# EAGLE design MRCS-Remote-Switch-Motor-Controller-Relay (EAGLE 7.7.0)
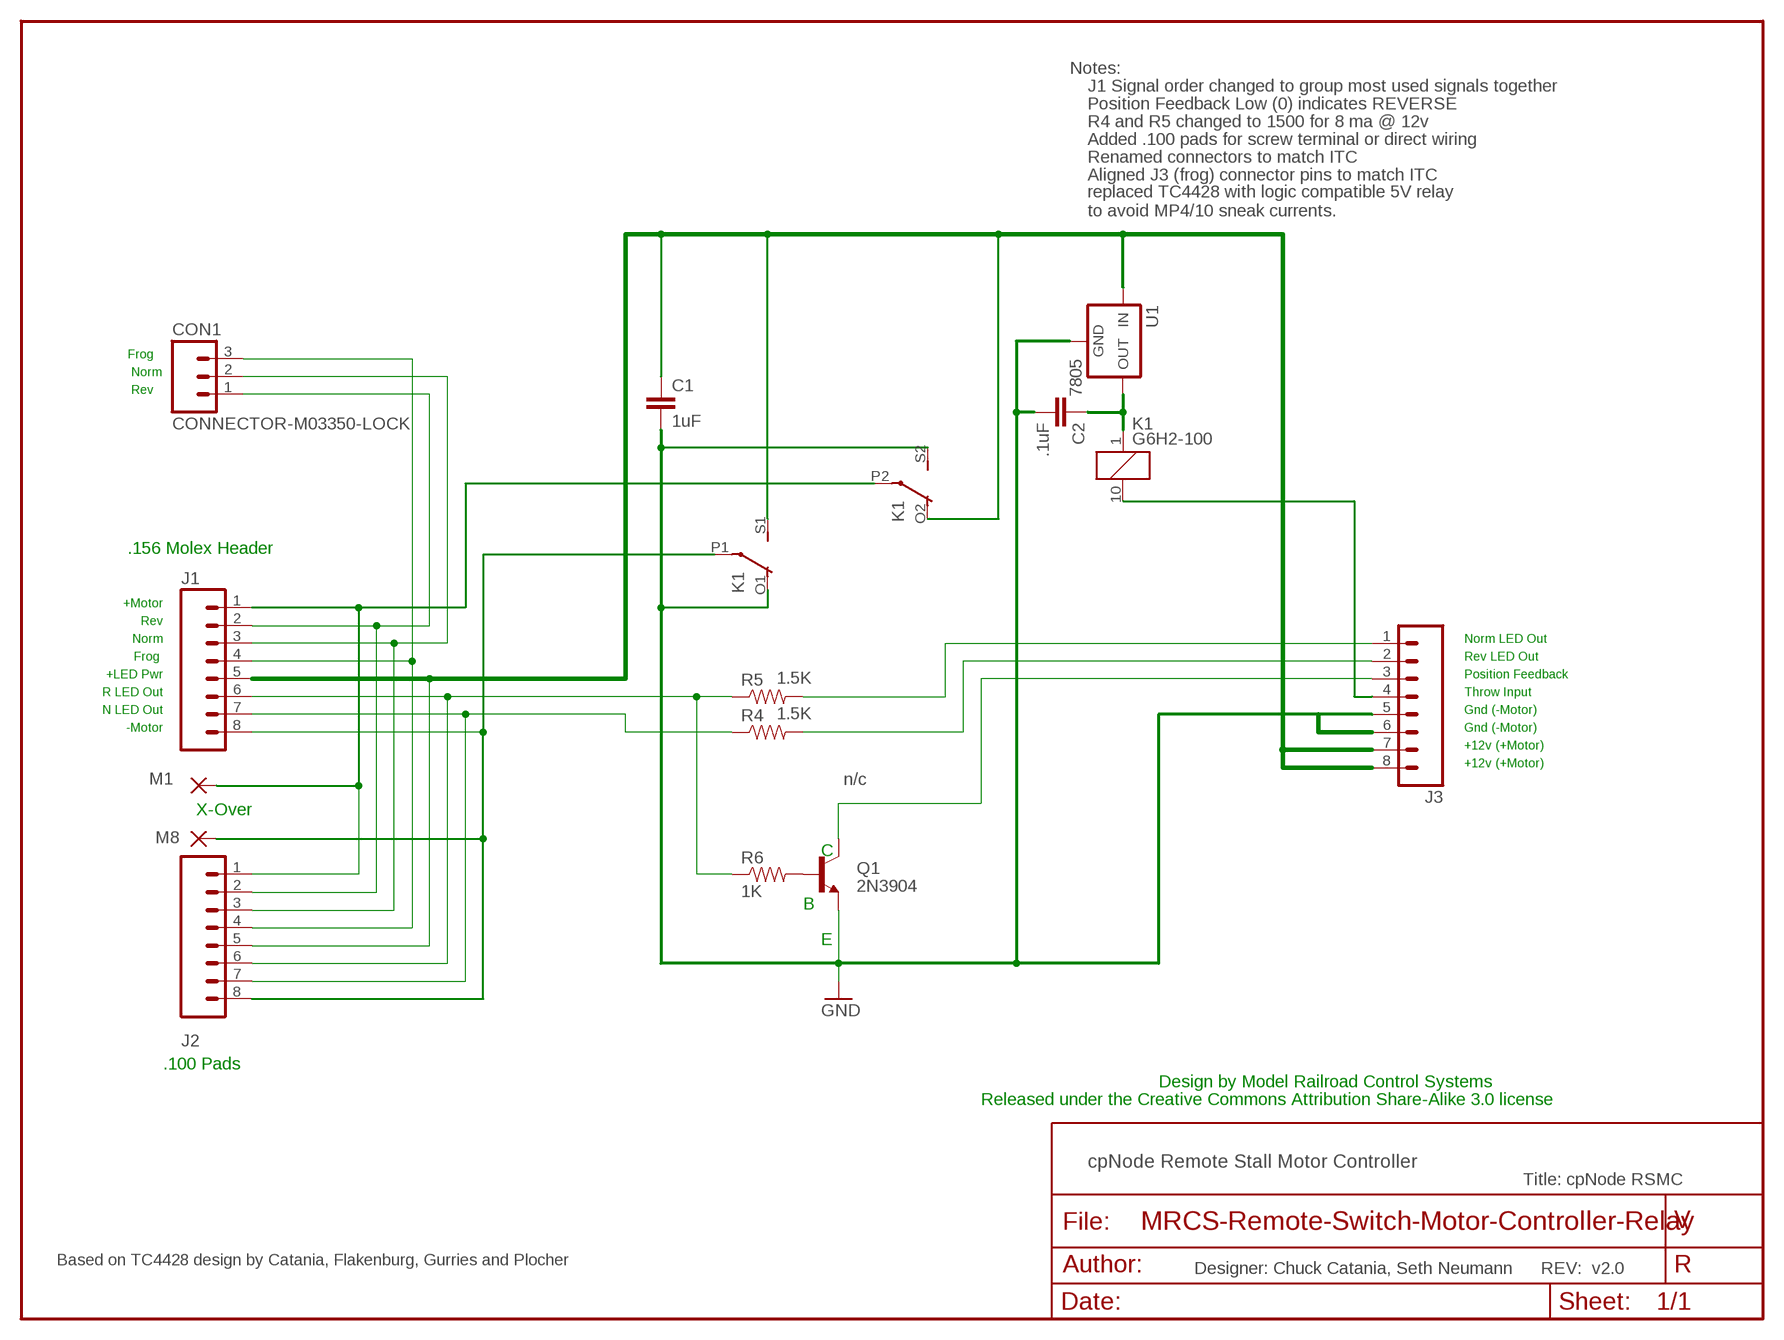
[diagram p0: schematic, sheet 1]

## Parts
C1  1uF  CAPEZ  [CAP-PTH-SMALLEZ]
C2  .1uF  CAPEZ  [CAP-PTH-SMALLEZ]
CON1  CONNECTOR-M03350-LOCK  [1751251]
J1  J1  CONNECTOR-M081.56-F  [KK-156-8-F]
J2  J2  M08  [1X08_PIN1_NO_SILK]
J3  CONNECTOR-M08LOCK  [1X08_LOCK]
K1  G6H2-100  [G6H2-100]
M1  WIREPAD2,54/1,1  [2,54/1,1]
M8  WIREPAD2,54/1,1  [2,54/1,1]
Q1  2N3904  NPN-MS-013  [TO-92-MS013]
R4  1.5K  RPTH04  [AXIAL-0.4-RES]
R5  1.5K  RPTH04  [AXIAL-0.4-RES]
R6  1K  RPTH04  [AXIAL-0.4-RES]
U1  7805  78XX-TO92  [TO92D-]

## Nets
+5: C2.1 K1.1 U1.3(VOUT)
+12: C1.1 J1.5 J2.5 J3.7 J3.8 K1.O2(3:O) K1.S1(2:S) U1.1(VIN)
FROG: CON1.3 J1.4 J2.4
GND: C1.2 C2.2 J3.5 J3.6 K1.O1(2:O) K1.S2(3:S) Q1.1(E) U1.2(GND)
M1: J1.1 J2.1 K1.P2(3:P) M1.1(P)
M8: J1.8 J2.8 K1.P1(2:P) M8.1(P)
N$3: J3.3 Q1.3(C)
N$4: J3.2 R4.P$2
N$8: Q1.2(B) R6.P$2
N$9: J3.1 R5.P$2
N-LED: J1.7 J2.7 R4.P$1
NORM: CON1.2 J1.3 J2.3
R-LED: J1.6 J2.6 R5.P$1 R6.P$1
REV: CON1.1 J1.2 J2.2
THROW: J3.4 K1.10

## Notes on the sheet
- Notes:
- J1 Signal order changed to group most used signals together
- Position Feedback Low (0) indicates REVERSE
- R4 and R5 changed to 1500 for 8 ma @ 12v
- Added .100 pads for screw terminal or direct wiring
- Renamed connectors to match ITC
- Aligned J3 (frog) connector pins to match ITC
- replaced TC4428 with logic compatible 5V relay 
  to avoid MP4/10 sneak currents.
- Frog
- Norm
- Rev
- .156 Molex Header
- +Motor
- Rev
- Norm | Norm LED Out
- Frog | Rev LED Out
- +LED Pwr | Position Feedback
- R LED Out | Throw Input
- N LED Out | Gnd (-Motor)
- -Motor | Gnd (-Motor)
- +12v (+Motor)
- +12v (+Motor)
- n/c
- X-Over
- C
- B
- E
- .100 Pads
- Design by Model Railroad Control Systems
- Released under the Creative Commons Attribution Share-Alike 3.0 license
- cpNode Remote Stall Motor Controller
- Title: cpNode RSMC
- Based on TC4428 design by Catania, Flakenburg, Gurries and Plocher
- Designer: Chuck Catania, Seth Neumann | REV:  v2.0

## Library data of the parts
C1 C2 = SparkFun-Passives:CAP: Capacitor Standard 0603 ceramic capacitor, and 0.1" leaded capacitor.
CON1 = SPCoast:CONNECTOR-M03
J1 J3 = SPCoast:CONNECTOR-M08: Header 8 Standard 8-pin 0.1" header. Use with straight break away headers (SKU : PRT-00116), right angle break away headers (PRT-00553), swiss pins (PRT-00743), machine pins (PRT-00117), and female headers (PRT-00115).
J2 = SparkFun-Connectors:M08: Header 8 Standard 8-pin 0.1" header. Use with straight break away headers (SKU : PRT-00116), right angle break away headers (PRT-00553), swiss pins (PRT-00743), machine pins (PRT-00117), and female headers (PRT-00115).
K1 = relay:G6H2-100: RELAY 2 x switch, 0.5 A/125 V AC, 1 A/30 V DC, Omron; OC_FARNELL: unknown; OC_NEWARK: unknown
M1 M8 = wirepad:WIREPAD: Wire PAD connect wire on PCB
Q1 = SPCoast:NPN: Transistor NPN BJT configuration in SOT23 package. MMBT2222 is the common NPN we use. Double check BCE configuration again layout.
R4-R6 = SPCoast:R*: Resistor Basic schematic elements and footprints for 0603, 1206, and PTH 1/10th watt (small) resistors.
U1 = bt_regulator:78XX: 78XX Linear Voltage Regulator The venerable 7800-series Linear Voltage Regulator, including 7805, 7809, 7812, 7815, 7862 in 5 V, 6.2 V, 8.2 V, 9 V, 12 V, and 15 V, respectively Datasheets TI_LM78L05.pdf <http://www.ti.com/lit/ds/symlink/lm78l05.pdf> Fairchild_LM7805.pdf <https://www.fairchildsemi.com/datasheets/LM/LM7805.pdf>

## Board
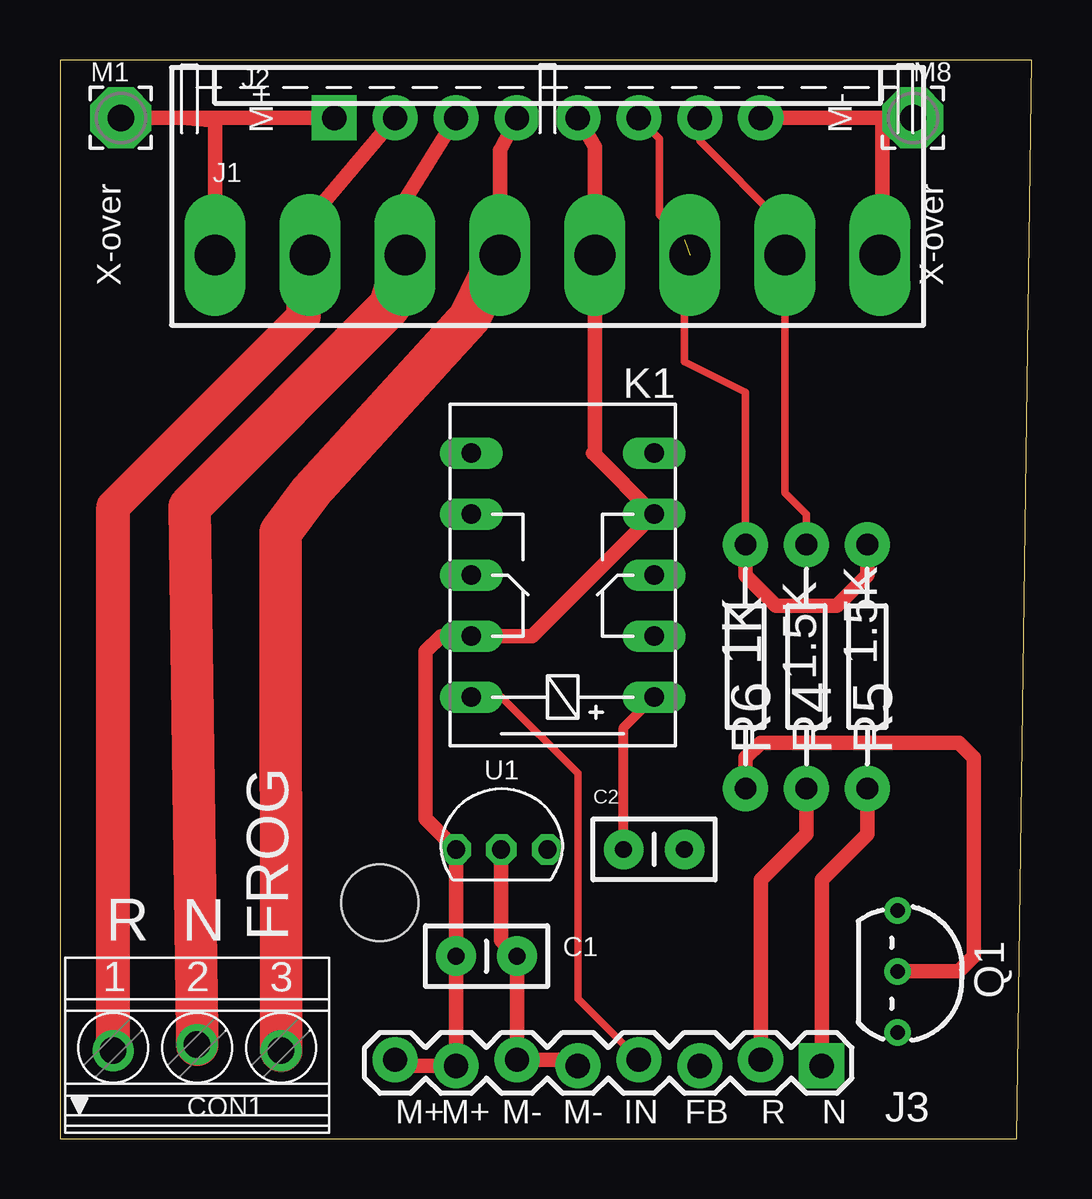
[diagram p1: board, top side]
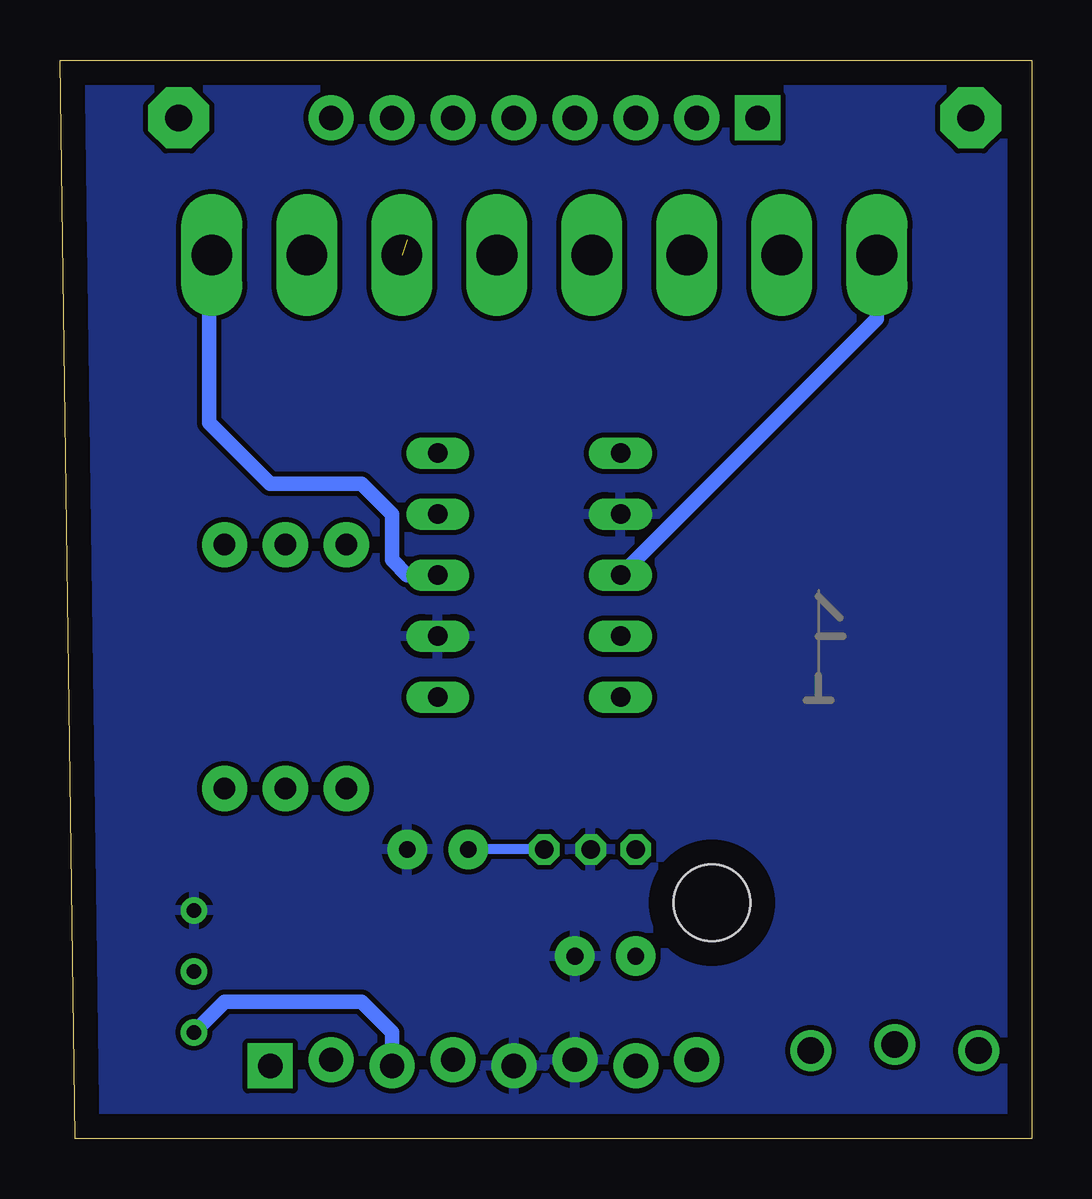
[diagram p2: board, bottom side, seen from below]

Size 40.51 x 44.96 mm. Coordinates in mm from the lower left corner, seen from the top.
Outline: 0,0 39.88,0 40.51,44.96 0,44.96 0,0
Copper layers (1*16): Top 0.035mm / dielectric 1.5mm / Bottom 0.035mm
Design rules "default": minimum track width 10mil, minimum drill 0.6mm, track to track 8mil, track to pad 8mil, pad to pad 8mil, via to via 8mil, smd to smd 8mil, copper to edge 40mil, drill to drill 8mil, minimum pad ring 10mil, minimum via ring 8mil, stop-mask expansion 4mil, vias tented up to drill 0mil, thermal gap 10mil
Holes 3.2 mm at 13.34,9.84

### Footprints (pad centres in the part's own frame; a part is rotated, then mirrored left to right if it is on the bottom)
CAP-PTH-SMALLEZ = drill 0.7 pad 1.651: 1 0,0; 2 2.54,0
1751251 = drill 1.1 pad 1.7: 1 -3.5,-0.127; 2 0,0.127; 3 3.5,-0.127
KK-156-8-F = drill 1.7 pad 2.184 long: 1 -13.86,0; 2 -9.9,0; 3 -5.94,0; 4 -1.98,0; 5 1.98,0; 6 5.94,0; 7 9.9,0; 8 13.86,0
1X08_PIN1_NO_SILK = drill 1.016 pad 1.88 square: 1 0,0 | drill 1.016 pad 1.88: 2 2.54,0; 3 5.08,0; 4 7.62,0; 5 10.16,0; 6 12.7,0; 7 15.24,0; 8 17.78,0
1X08_LOCK = drill 1.016 pad 1.88 square: 1 0,0.127 | drill 1.016 pad 1.88: 2 2.54,-0.127; 3 5.08,0.127; 4 7.62,-0.127; 5 10.16,0.127; 6 12.7,-0.127; 7 15.24,0.127; 8 17.78,-0.127
G6H2-100 = drill 0.813 long: 1 -5.08,-3.81; 5 5.08,-3.81; 6 5.08,3.81; 10 -5.08,3.81; O1 -2.54,-3.81; O2 -2.54,3.81; P1 0,-3.81; P2 0,3.81; S1 2.54,-3.81; S2 2.54,3.81
2,54/1,1 = drill 1.118 pad 2.54 octagon: 1 0,0
TO-92-MS013 = drill 0.6: 1 -2.54,0; 2 0,0; 3 2.54,0
AXIAL-0.4-RES = drill 0.9 pad 1.88: P$1 -5.08,0; P$2 5.08,0
TO92D- = drill 0.762 octagon: 1 -1.905,0; 2 -0.025,0; 3 1.905,0

### Placement (x,y rotation side)
C1  16.51,7.62 0 top
C2  23.5,12.06 0 top
CON1  5.71,3.81 0 top
J1  20.32,36.83 0 top
J2  11.43,42.55 0 top
J3  31.75,3.17 180 top
K1  20.95,23.5 90 top
M1  2.54,42.55 0 top
M8  35.56,42.55 0 top
Q1  34.92,6.99 270 top
R4  31.11,19.68 270 top
R5  33.66,19.68 270 top
R6  28.57,19.68 270 top
U1  18.41,12.06 0 top
U$1  [MRCSLOGOBTM]  2.54,17.78 0 top
U$2  [CA-PROP65WARNING]  24.13,35.56 0 top

### Tracks (layer width: path | path; a pad name or v marks a point on that pad's centre or on a via)
+5
  Top 0.406: C2.1 23.5,17.14 K1.1
  Bottom 0.406: U1.3 C2.1
+12
  Top 0.61: J2.5 22.3,41.35 J1.5 22.3,28.5 | 22.23,28.57 22.3,28.5 | 22.3,28.5 K1.S1 19.68,20.95 K1.O2 15.88,20.95 15.24,20.32 15.24,13.34 U1.1 C1.1 J3.7 14.22,3.05 J3.8
FROG
  Top 0.61: J1.4 18.34,41.2 J2.4
  Top 1.778: J1.4 17.07,34.22 10.48,26.99 9.21,25.28 CON1.3
GND
  Top 0.61: U1.2 18.39,8.28 C1.2 J3.6 21.34,3.3 J3.5
  pour Bottom: 0,0 40.01,0 40.64,45.09 0,45.09
M1
  Top 0.61: M1.1 5.08,42.55 | 5.08,42.55 J2.1 | J1.1 6.46,42.44 5.08,42.55
  Bottom 0.61: J1.1 6.46,34.18 K1.P2
M8
  Top 0.61: J2.8 34.29,42.55 | 34.29,42.55 M8.1 | J1.8 34.29,37.58 34.29,42.55
  Bottom 0.61: K1.P1 26.04,23.5 26.67,24.13 26.67,26.04 27.94,27.3 31.75,27.3 34.29,29.84 34.29,36.72 J1.8
N$3
  Bottom 0.61: J3.3 26.67,4.45 27.94,5.71 33.66,5.71 Q1.3
N$4
  Top 0.61: R4.P$2 31.11,12.7 29.21,10.79 J3.2
N$8
  Top 0.61: Q1.2 37.47,6.99 38.1,7.62 38.1,15.88 37.47,16.51 29.21,16.51 28.57,15.88 R6.P$2
N$9
  Top 0.61: R5.P$2 33.66,12.7 31.75,10.79 J3.1
N-LED
  Top 0.305: J2.7 26.67,41.59 30.16,38.1 30.16,36.89 J1.7 30.22,26.93 31.11,26.04 R4.P$1
NORM
  Top 0.61: J1.3 14.38,39.15 J2.3
  Top 1.778: J1.3 13.74,34.7 5.4,26.35 5.71,4.45 CON1.2
R-LED  (1 unrouted)
  Top 0.305: J2.6 24.99,41.69 24.99,38.51 26.04,37.47 26.04,32.38 28.57,31.11 R6.P$1
  Top 0.61: R6.P$1 28.57,23.5 29.84,22.23 32.38,22.23 33.66,23.5 R5.P$1
REV
  Top 0.61: 13.97,41.91 J2.2 10.42,38.36 J1.2
  Top 1.422: CON1.1 2.21,24.44 2.22,26.35 10.16,34.29 10.16,36.57 J1.2
THROW
  Top 0.305: K1.10 18.41,18.41 21.59,15.24 21.59,5.84 J3.4

### Text on the board
tPlace: M+ | M- | X-over | X-over | R | N | FROG | M+ | M+ | M- | M- | IN | FB | R | N
bDocu: RSMC-relay V2.0
_tNames: M1 | M1 | M1 | M8 | M8 | M8 | J2 | J2 | J2 | J1 | J1 | J1 | U1 | U1 | U1 | R3 | R3 | R3 | R6 | R6 | R6 | R4 | R4 | R4 | R5 | R5 | R5 | C1 | C1 | C1 | Q1 | Q1 | Q1 | ST1 | ST1 | ST1 | CON1 | CON1 | CON1